# EAGLE design AnyPDB (EAGLE 6.5.0)
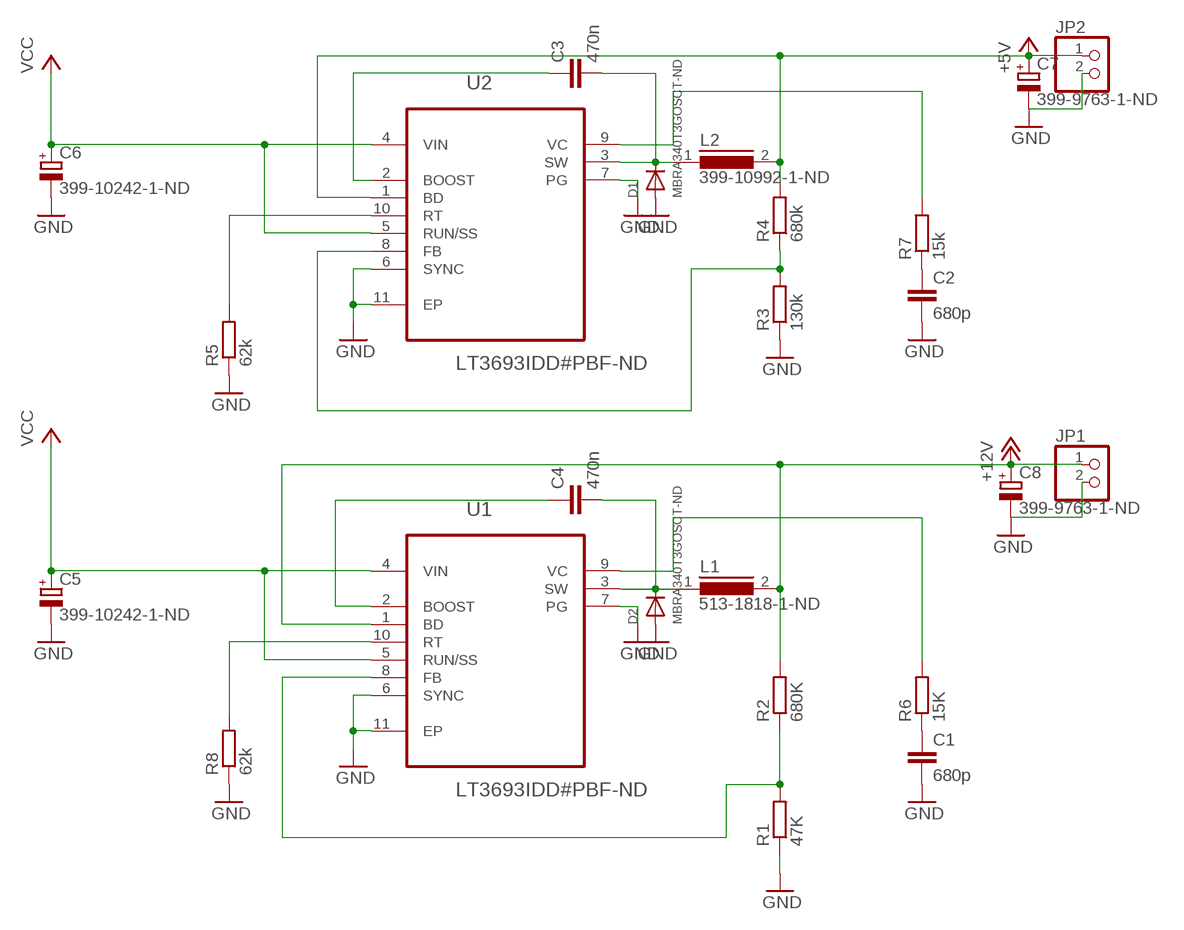
[diagram p0: schematic, sheet 1]

## Parts
C1  680p  C-EUC0402K  [C0402K]
C2  680p  C-EUC0402K  [C0402K]
C3  470n  C-EUC0402K  [C0402K]
C4  470n  C-EUC0402K  [C0402K]
C5  399-10242-1-ND  CPOL-EUCT6032  [CT6032]
C6  399-10242-1-ND  CPOL-EUCT6032  [CT6032]
C7  399-9763-1-ND  CPOL-EUCT6032  [CT6032]
C8  399-9763-1-ND  CPOL-EUCT6032  [CT6032]
D1  MBRA340T3GOSCT-ND  DIODESMA  [SMADIODE]
D2  MBRA340T3GOSCT-ND  DIODESMA  [SMADIODE]
JP1  PINHD-1X02_2.54-S  [1X02-S]
JP2  PINHD-1X02_2.54-S  [1X02-S]
L1  513-1818-1-ND  DR74  [DR74]
L2  399-10992-1-ND  DR74  [DR74]
R1  47K  R-EU_R0402  [R0402]
R2  680K  R-EU_R0402  [R0402]
R3  130k  R-EU_R0402  [R0402]
R4  680k  R-EU_R0402  [R0402]
R5  62k  R-EU_R0402  [R0402]
R6  15K  R-EU_R0402  [R0402]
R7  15k  R-EU_R0402  [R0402]
R8  62k  R-EU_R0402  [R0402]
U1  LT3693IDD#PBF-ND  LT3693IDDPBF  [DFN300X300X80-11N]
U2  LT3693IDD#PBF-ND  LT3693IDDPBF  [DFN300X300X80-11N]

## Nets
+5V: C7.+ JP2.1 L2.2 R4.2 U2.1(BD)
+12V: C8.+ JP1.1 L1.2 R2.2 U1.1(BD)
GND: C1.2 C2.2 C5.- C6.- C7.- C8.- D1.A D2.A JP1.2 JP2.2 R1.1 R3.1 R5.1 R8.1 U1.6(SYNC) U1.7(PG) U1.11(EP) U2.6(SYNC) U2.7(PG) U2.11(EP)
N$1: R1.2 R2.1 U1.8(FB)
N$2: R3.2 R4.1 U2.8(FB)
N$5: C4.2 D2.C L1.1 U1.3(SW)
N$6: C3.2 D1.C L2.1 U2.3(SW)
N$7: R5.2 U2.10(RT)
N$8: R7.2 U2.9(VC)
N$9: R6.2 U1.9(VC)
N$10: R8.2 U1.10(RT)
N$11: C1.1 R6.1
N$12: C2.1 R7.1
N$13: C4.1 U1.2(BOOST)
N$14: C3.1 U2.2(BOOST)
VCC: C5.+ C6.+ U1.4(VIN) U1.5(RUN/SS) U2.4(VIN) U2.5(RUN/SS)

## Library data of the parts
C1-C4 = rcl:C-EU: CAPACITOR, European symbol
C5-C8 = rcl:CPOL-EU: POLARIZED CAPACITOR, European symbol
D1 D2 = adafruit:DIODE: Diode SMADIODE - SMA Surface Mount Package 20V 1A Schottky Diode Digikey: 641-1014-6-ND DO-1N4148 - Through Hole Small Current Diode SOD-123 20V 1 A (.5mV Vf) Schottky Diode - Digikey: MBRX120TPMSCT-ND SOD-323 10V 570mA (.38mV Vf, 3ns) Schottky Diode - Digikey: ZLLS410CT-ND SOD-523 30V 30mA Schottky Diode (RB751S-40TE61) - Digikey: RB751S-40TE61CT-ND SOT23-R/W - SOT23 Package (R = Solder Paste/Reflow Ovens, W = Hand-Soldering) BAT54Film 40V 300mA - Digikey: 497-7162-1-ND
JP1 JP2 = pinhead-2:PINHD-1X02: PIN HEADER
L1 L2 = inductors:DR74: High Power Density, High Efficiency, Shielded Inductors Source: coiltronics_dr_series.pdf
R1-R8 = rcl:R-EU_: RESISTOR, European symbol
U1 U2 = LT3693:LT3693IDDPBF: 36V, 3.5A, 2.4MHz Step-Down Switching Regulator; MPN: LT3693IDD#PBF; OC_FARNELL: 2294946; OC_NEWARK: 57M8572; PACKAGE: DFN-10; SUPPLIER: Linear Technology

## Board
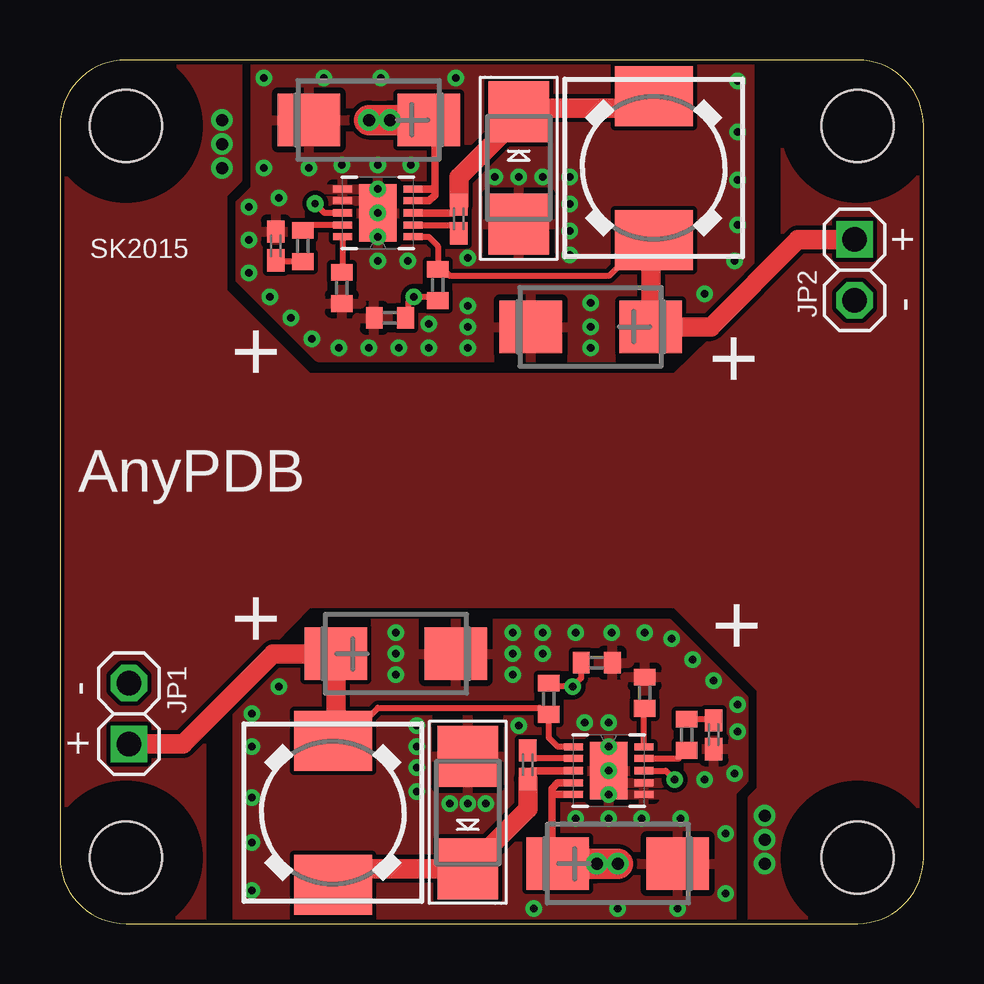
[diagram p1: board, top side]
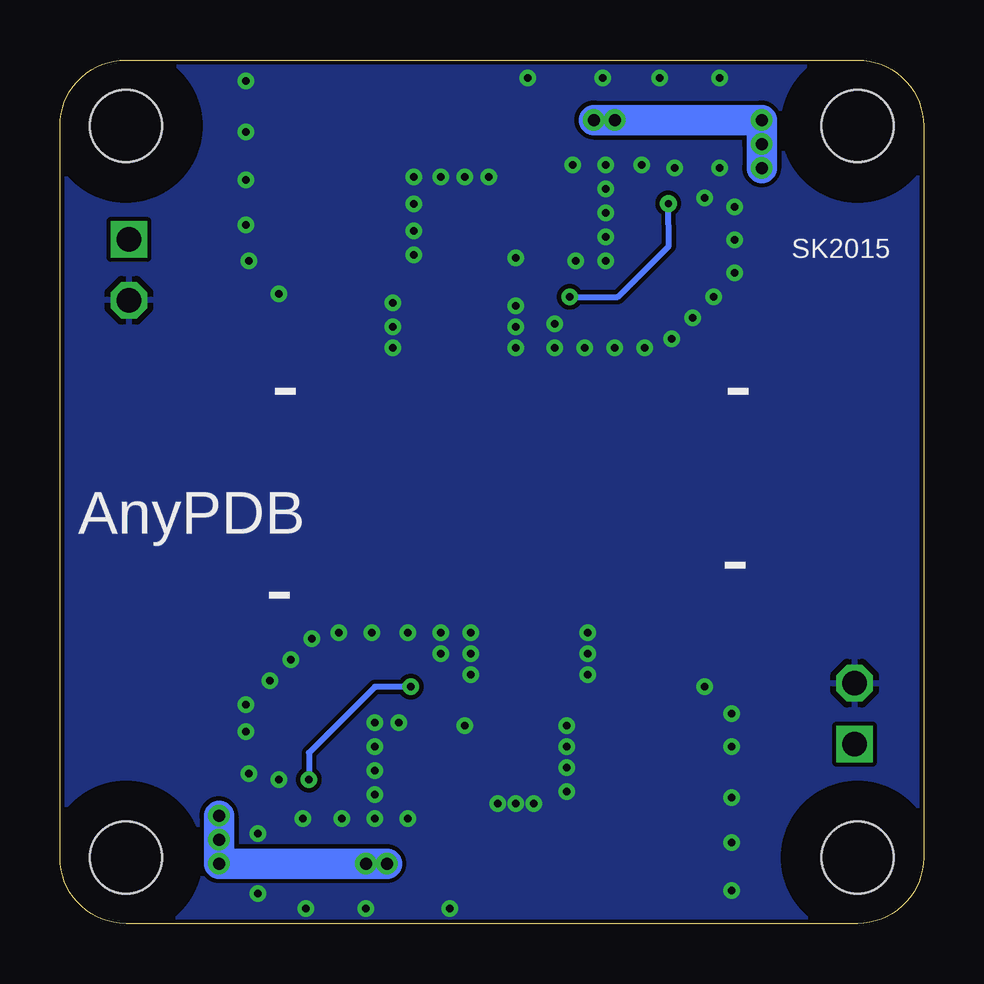
[diagram p2: board, bottom side, seen from below]

Size 36 x 36 mm. Coordinates in mm from the lower left corner, seen from the top.
Outline: 0,2.75 arc90 2.75,0 33.25,0 arc90 36,2.75 36,33.25 arc90 33.25,36 2.75,36 arc90 0,33.25 0,2.75
Copper layers (1*16): Top 0.0356mm / dielectric 1.5011mm / Bottom 0.0356mm
Design rules "7mils GUS Engineering *": minimum track width 7mil, minimum drill 15mil, track to track 7mil, track to pad 7mil, pad to pad 7mil, via to via 7mil, smd to smd 7mil, copper to edge 7mil, drill to drill 7mil, minimum pad ring 10mil, minimum via ring 8mil, stop-mask expansion 4mil, vias tented up to drill 25mil, thermal gap 10mil
Holes 3 mm at 2.75,2.75 2.75,33.25 33.25,33.25 33.25,2.75
tRestrict: area -0.2,-0.2 to 5.8,5.8; area 30.2,-0.2 to 36.2,5.8; area 30.2,30.2 to 36.2,36.2; area -0.2,30.2 to 5.8,36.2
bRestrict: area -0.2,-0.2 to 5.8,5.8; area 30.2,-0.2 to 36.2,5.8; area 30.2,30.2 to 36.2,36.2; area -0.2,30.2 to 5.8,36.2

### Footprints (pad centres in the part's own frame; a part is rotated, then mirrored left to right if it is on the bottom)
C0402K = smd 0.925 x 0.74: 1 -0.6,0; 2 0.6,0
CT6032 = smd 2.6 x 2.2: + -2.5,0; - 2.5,0
SMADIODE = smd 2.54 x 2.54: A 2.349,0; C -2.349,0
1X02-S = drill 1.016 square: 1 -1.27,0 | drill 1.016 octagon: 2 1.27,0
DR74 = smd 2.5 x 3.25: 1 -3,0; 2 3,0
R0402 = smd 0.7 x 0.9: 1 -0.65,0; 2 0.65,0
DFN300X300X80-11N = smd 0.787 x 0.305: 1 -1.473,0.991; 2 -1.473,0.508; 3 -1.473,0; 4 -1.473,-0.508; 5 -1.473,-0.991; 6 1.473,-0.991; 7 1.473,-0.508; 8 1.473,0; 9 1.473,0.508; 10 1.473,0.991 | smd 1.549 x 2.388: 11 0,0

### Placement (x,y rotation side)
C1  27.25,7.88 270 top
C2  9,28.25 90 top
C3  16.62,29.38 90 top
C4  19.5,6.62 270 top
C5  23.25,2.5 0 top
C6  12.88,33.5 180 top
C7  22.12,24.88 180 top
C8  14,11.25 0 top
D1  19.12,31.5 270 top
D2  17,4.62 90 top
JP1  2.88,8.75 90 top
JP2  33.12,27.25 270 top
L1  11.38,4.62 90 top
L2  24.75,31.5 270 top
R1  22.38,10.88 180 top
R2  20.38,9.38 270 top
R3  13.75,25.25 0 top
R4  15.75,26.62 90 top
R5  11.75,26.5 90 top
R6  26.12,7.88 270 top
R7  10.12,28.25 90 top
R8  24.38,9.62 270 top
U1  22.88,6.38 0 top
U2  13.25,29.62 180 top

### Tracks (layer width: path | path; a pad name or v marks a point on that pad's centre or on a via)
+5V
  Top 0.254: U2.1 15.37,28.63 15.75,28.25 15.75,27.5 | 15.75,27.5 R4.2 15.85,27.5 15.75,27.5 | L2.2 24,28.12 22.88,27 16.25,27 15.75,27.5
  Top 0.813: L2.2 24.75,28 24.62,28 C7.+ 27.12,24.88 30.77,28.52 JP2.1
+12V
  Top 0.254: U1.1 20.76,7.37 20.38,7.75 R2.2 19.98,9 13.25,9 11.88,7.62 | 11.5,8 11.88,7.62 | 11.88,7.62 12,7.5 11.5,7.5 L1.2 11.75,7.62
  Top 0.813: 11.5,8 C8.+ 8.89,11.25 5.12,7.48 4.97,7.48 JP1.1
GND  (via drill 0.3)
  other vias: 14.88,6.5 16.25,5 17,5 8,1.38 14.88,7.38 14.88,8.25 14.88,5.5 14,10.38 14,12.12 18.88,12.12 18.88,10.38 20.12,31.12 19.12,31.12 18.12,31.12 17,27.75 21.25,28.88 21.25,27.88 15.38,25 17,25.75 22.12,25.88 22.12,24.88 17,24.88 14.5,27.62 9.62,25.25 7.88,27.12 7.88,29.88 8.5,35.25 16.5,35.25 9.12,9.88 8,8.75 14,11.25 8,7.38 26.88,6 19.75,0.62 25.88,4.38 27.75,1.25 25.75,0.62 23.25,0.62 22.88,4.38 27.75,3.75 24.25,4.38 21.5,4.38 22.88,5.38 22.88,6.38 22.88,7.38 22.88,8.38 27.25,10.12 25.5,11.88 24.38,12.12 21.5,12.12 11.62,24 15.38,24 17,24 22.12,24 13.25,29.62 13.25,30.62 13.25,28.62 13.25,31.62 13.25,27.62 28.12,6.25 28.25,9.12 18.88,11.25 8.5,31.5 10.38,31.5 14.62,31.62 11.75,31.62 12.88,24 20.12,11.25 20.12,12.12 23,12.12 21.88,8.38 26.38,11 8.75,26.12 10.5,24.38 14.12,24 7.88,28.5 26.88,26.25 28.12,27.62 28.25,35.12 28.25,33 28.25,31 28.25,29.12 8,3.38 8,5.25 21.25,31.12 21.25,30 19.12,8.25 17.75,5 11,35.25 13.38,35.25 28.25,8 9.12,30.25
  pour Bottom: 0,0 0,36 36,36 36,0
  pour Top: 7.38,0 28,0 28,5.5 28.5,6 28.5,9.38 25.38,12.5 9.88,12.5 7.38,9.88
  pour Top: 7.5,26.88 10.75,23.62 27,23.62 28.75,25.38 28.75,36 8.12,36 8.12,30.62 7.5,30
N$1  (via drill 0.3)
  Top 0.254: R2.1 20.38,10 20.48,9.9 21.35,9.9 v21.38,9.88 21.73,10.22 R1.2 | U1.8 25.25,6.38 v25.62,6
  Bottom 0.254: v21.38,9.88 22.88,9.88 25.62,7.12 v25.62,6
N$2  (via drill 0.3)
  Top 0.254: U2.8 11.03,29.62 v10.64,30.01 | 15.65,25.98 15.72,25.98 | 15.72,25.98 R4.1 | 15.72,25.98 15.75,26.12 v14.75,26.12 | 14.6,25.98 v14.75,26.12 | R3.2 14.53,25.27 14.53,25.9 v14.75,26.12
  Bottom 0.254: v14.75,26.12 12.75,26.12 10.62,28.25 v10.64,30.01
N$5
  Top 0.254: 12.03,2.28 L1.1
  Top 0.305: U1.3 19.65,6.38 C4.2
  Top 0.813: C4.2 19.5,4.78 D2.C 12.03,2.28
N$6
  Top 0.254: 16.38,29.62 16.75,30 16.75,30.12 C3.2
  Top 0.305: U2.3 16.38,29.62
  Top 0.813: C3.2 16.62,31.12 18.88,33.38 18.85,33.12 | 18.85,33.12 19.1,33.13 D1.C | L2.1 24.25,34 19.75,34 18.88,33.12 18.85,33.12
N$7
  Top 0.254: U2.10 11.78,27.32 R5.2
N$8
  Top 0.254: U2.9 10.47,29.12 R7.2
N$9
  Top 0.254: U1.9 25.78,6.88 R6.2
N$10
  Top 0.254: U1.10 24.35,8.95 R8.2
N$11
  Top 0.254: R6.1 27.2,8.53 C1.1
N$12
  Top 0.254: R7.1 9.3,27.6 C2.1
N$13
  Top 0.254: U1.2 19.72,6.88 C4.1
N$14
  Top 0.254: U2.2 16.26,29.12 16.5,28.88 16.5,28.75 16.62,28.72 C3.1
VCC  (via drill 0.5)
  Top 0.254: 15.62,33.25 14.25,34 15,33.75 C6.+ | 20.5,3 C5.+ | 20.63,5.38 20.5,5.25
  Top 0.305: U2.4 15.38,30.13 15.62,30.38 15.62,30.75 | 15.62,30.75 15.62,33.25 | U1.4 20.74,5.87 20.5,5.62 20.5,5.25 20.5,3 | U1.5 20.63,5.38 | U2.5 15.49,30.62 15.62,30.75
  Top 1.27: C6.+ v13.75,33.5 v12.88,33.5 | C5.+ v22.38,2.5 v23.25,2.5
  Bottom 1.27: v13.75,33.5 v6.75,33.5 v6.75,32.5 v6.75,31.5 | v22.38,2.5 v29.38,2.5 v29.38,4.5
  other vias: 29.38,3.5
  pour Top: 0,0 0,36 7.5,36 7.5,31 6.88,30.38 6.88,26.38 10.38,22.88 25.62,22.88 30.12,27.25 30.12,36 36,36 36,0 28.75,0 28.75,5.25 29.12,5.62 29.12,9.75 25.62,13.25 10.38,13.25 6,8.75 6,0

### Text on the board
tPlace: SK2015 | + | - | + | + | AnyPDB | + | + | - | +
bPlace: SK2015 | - | - | - | AnyPDB | -